# Altium schematic sheet 7V_Buck.SchDoc
size 259 x 167 mm; SheetNumber: 5; SheetTotal: 7
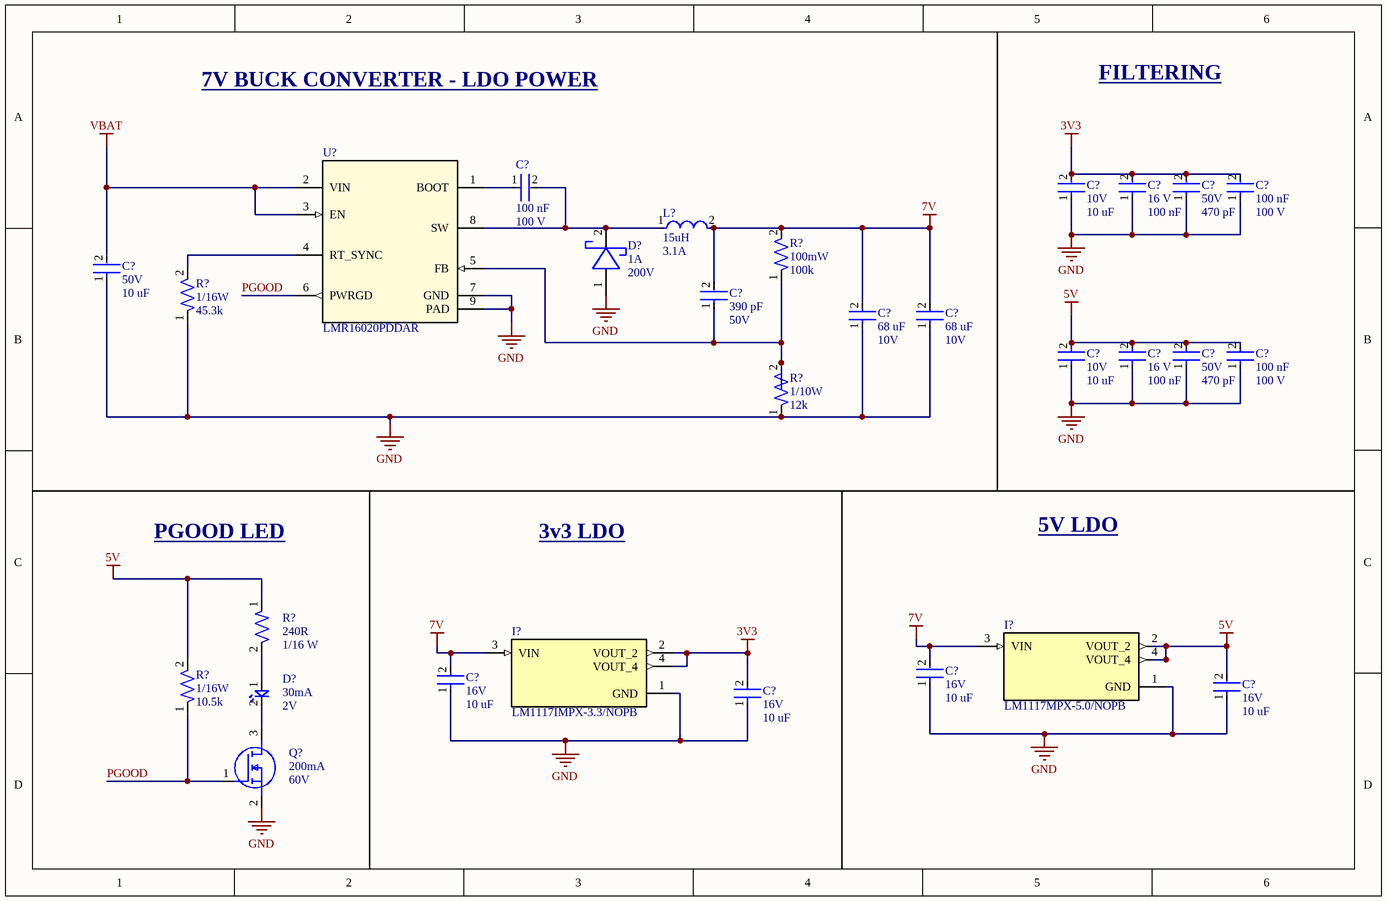
[diagram p0: 7V_Buck.SchDoc]

## Parts
(Parts that share a designator on the sheet are numbered #1, #2 ... from top to bottom, then left to right.)
C?#1  Capacitance: 100 nF  Voltage: 100 V  [CAP-0603]  (hidden comment: CC0603KRX7R0BB104)
C?#2  Voltage: 10V  Capacitance: 10 uF  [CAP-0603]  (hidden comment: CC0603KRX5R6BB106)
C?#3  Voltage Rating: 16 V  Capacitance: 100 nF  [CAP-0402]  (hidden comment: CC0402KRX7R7BB104)
C?#4  Voltage: 50V  Capacitance: 470 pF  [CAP-0805]  (hidden comment: CC0805JRNPO9BN471)
C?#5  Capacitance: 100 nF  Voltage: 100 V  [CAP-0603]  (hidden comment: CC0603KRX7R0BB104)
C?#6  Voltage Rating (DC): 50V  Capacitance: 10 uF  [FP-CL32-IPC_B]  (hidden comment: CL32B106KBJNNNE)
C?#7  Capacitance: 390 pF  Voltage: 50V  [CAP-0402]  (hidden comment: GRM155R71H391KA01D)
C?#8  Capacitance: 68 uF  Voltage: 10V  [CAP-1210]  (hidden comment: C5750X5R1A686MT000N)
C?#9  Capacitance: 68 uF  Voltage: 10V  [CAP-1210]  (hidden comment: C5750X5R1A686MT000N)
C?#10  Voltage: 10V  Capacitance: 10 uF  [CAP-0603]  (hidden comment: CC0603KRX5R6BB106)
C?#11  Voltage Rating: 16 V  Capacitance: 100 nF  [CAP-0402]  (hidden comment: CC0402KRX7R7BB104)
C?#12  Voltage: 50V  Capacitance: 470 pF  [CAP-0805]  (hidden comment: CC0805JRNPO9BN471)
C?#13  Capacitance: 100 nF  Voltage: 100 V  [CAP-0603]  (hidden comment: CC0603KRX7R0BB104)
C?#14  Voltage: 16V  Capacitance: 10 uF  [CAP-1210]  (hidden comment: 293D106X9016A2TE3)
C?#15  Voltage: 16V  Capacitance: 10 uF  [CAP-1210]  (hidden comment: 293D106X9016A2TE3)
C?#16  Voltage: 16V  Capacitance: 10 uF  [CAP-1210]  (hidden comment: 293D106X9016A2TE3)
C?#17  Voltage: 16V  Capacitance: 10 uF  [CAP-1210]  (hidden comment: 293D106X9016A2TE3)
D?#1  Current Rating: 1A  Reverse Voltage: 200V  [SMA_DIO]  (hidden comment: SS1200)
D?#2  Current Rating: 30mA  Vf: 2V  [LED0603-R-RD]  (hidden comment: BL-HKC36G-AV-TRB)
I?#1  LM1117MPX-5.0/NOPB  [IC-SOT-223-4]
I?#2  LM1117IMPX-3.3/NOPB  [IC-SOT-223-4]
L?  Inductance: 15uH  Current Rating: 3.1A  [IND-15UH-0001]  (hidden comment: CSAD1010-150M)
Q?  Id-Continuous: 200mA  VDS-Max: 60V  [NMOS-SOT23-3]  (hidden comment: T2N7002AK,LM)
R?#1  Power: 100mW  Resistance: 100k  [RES-0603]  (hidden comment: RC0603FR-07100KL)
R?#2  Power: 1/16W  Resistance: 45.3k  [RES-0402]  (hidden comment: RC0402FR-0745K3L)
R?#3  Power: 1/10W  Resistance: 12k  [RES-0603]  (hidden comment: RC0603FR-0712KL)
R?#4  Resistance: 240R  Power: 1/16 W  [RESC0402(1005)_L]  (hidden comment: RC0402FR-07240RL)
R?#5  Power: 1/16W  Resistance: 10.5k  [RES-0402]  (hidden comment: RC0402FR-0710K5L)
U?  LMR16020PDDAR  [IC-8SOPWR]

## Nets
3V3: C?#2.2 C?#3.2 C?#4.2 C?#5.2 C?#17.2 I?#2.2(VOUT_2) I?#2.4(VOUT_4)
5V: C?#10.2 C?#11.2 C?#12.2 C?#13.2 C?#16.2 I?#1.2(VOUT_2) I?#1.4(VOUT_4) R?#4.1 R?#5.2
7V: C?#7.2 C?#8.2 C?#9.2 C?#14.2 C?#15.2 I?#1.3(VIN) I?#2.3(VIN) L?.2 R?#1.2
GND: C?#2.1 C?#3.1 C?#4.1 C?#5.1 C?#6.1 C?#8.1 C?#9.1 C?#10.1 C?#11.1 C?#12.1 C?#13.1 C?#14.1 C?#15.1 C?#16.1 C?#17.1 D?#1.1(CATHODE) I?#1.1(GND) I?#2.1(GND) Q?.2(S) R?#2.1 R?#3.1 U?.7(GND) U?.9(PAD)
VBAT: C?#6.2 U?.2(VIN) U?.3(EN)
PGOOD: Q?.1(G) R?#5.1 U?.6(PWRGD)
NetC?#1_1: C?#1.1 U?.1(BOOT)
NetC?#1_2: C?#1.2 D?#1.2(ANODE) L?.1 U?.8(SW)
NetC?#7_1: C?#7.1 R?#1.1 R?#3.2 U?.5(FB)
NetD?#2_1: D?#2.1 R?#4.2
NetD?#2_2: D?#2.2 Q?.3(D)
NetR?#2_2: R?#2.2 U?.4(RT_SYNC)

## Notes on the sheet
- 7V BUCK CONVERTER - LDO POWER
- FILTERING
- PGOOD LED
- 3v3 LDO
- 5V LDO

## Library data of the parts
C?#1 C?#5 C?#13 = CAP-100N-0001: CAP CER 0.1UF 100V X7R 0603; Device Class: Ceramic; Size: 0603; ComponentLink1Description: Datasheet; ComponentLink1URL: https://www.yageo.com/upload/media/product/app/datasheet/mlcc/upy-np0x7r_mv_100-to-630v.pdf
C?#2 C?#10 = CAP-10U-0001: CAP CER 10UF 10V X5R 0603; ComponentLink1Description: Datasheet; ComponentLink1URL: https://www.yageo.com/upload/media/product/app/datasheet/mlcc/upy-gphc_x5r_4v-to-50v.pdf; Device Class: Ceramic; Size: 0603
C?#3 C?#11 = CAP-0.1U-0001: CAP CER 0.1UF 16V X7R 0402; ComponentLink2Description: Datasheet; ComponentLink2URL: https://www.yageo.com/upload/media/product/productsearch/datasheet/mlcc/UPY-GPHC_X7R_6.3V-to-250V_24.pdf; Device Class: Ceramic; Size: 0402
C?#4 C?#12 = CAP-470P-0001: CAP CER 470PF 50V C0G/NPO 0805; Device Class: Ceramic; Size: 0805; ComponentLink1Description: Datasheet; ComponentLink1URL: https://www.yageo.com/upload/media/product/productsearch/datasheet/mlcc/UPY-GP_NP0_16V-to-50V_18.pdf
C?#6 = CAP-10U-0002: CAP CER 10UF 50V X7R 1210; Tolerance: 10%; Material: Ceramic; Min Operating Temperature: -55°C; Depth: 2.5mm; Radiation Hardening: No; Packaging: Tape and Reel; Dielectric: X7R; Case Code (Metric): 3225; Height: 2.5mm; Thickness: 0.106inch; Voltage Rating: 50V; Width: 0.098inch; Case Code (Imperial): 1210; Length: 3.2mm; Lead Free: Lead Free; Package Quantity: 1; Voltage: 50V; Mount: Surface Mount; Case/Package: 1210; Max Operating Temperature: 125°C
C?#7 = CAP-390P-0001_1: CAP CER 390PF 50V X7R 0402; Device Class: Ceramic; Size: 0402; ComponentLink1Description: Datasheet; ComponentLink1URL: https://www.lcsc.com/datasheet/lcsc_datasheet_1912111437_Murata-Electronics-GRM155R71H391KA01D_C185563.pdf
C?#8 C?#9 = CAP-68U-0001: CAP CER 68UF 10V X5R 2220; Device Class: Ceramic; Size: 2220; ComponentLink1Description: Datasheet; ComponentLink1URL: https://www.lcsc.com/datasheet/lcsc_datasheet_2304140030_TDK-C5750X5R1A686MT000N_C342299.pdf
C?#14-C?#17 = CAP-10U-0003: CAP TANT 10UF 10% 16V 1206; Device Class: Tantalum; Size: 1206; ComponentLink1Description: Datasheet; ComponentLink1URL: https://www.lcsc.com/datasheet/lcsc_datasheet_2304140030_Vishay-Intertech-293D106X9016A2TE3_C110038.pdf
D?#1 = DIO-SCHOTTKY-0004: DIODE SCHOTTKY 200V 1A SMA; ComponentLink1Description: Datasheet; ComponentLink1URL: https://www.digikey.com/en/products/detail/mdd/ss1200/15911596
D?#2 = LED-0001: LED YELLOW CLEAR 0603 SMD
I?#1 = IC_LDO_5V_0001: IC REG LINEAR 5V 800MA SOT223-4; ComponentLink1Description: Datasheet; ComponentLink1URL: https://www.ti.com/lit/ds/symlink/lm1117.pdf?HQS=dis-dk-null-digikeymode-dsf-pf-null-wwe&ts=1721700739746
I?#2 = IC_LDO_3V3_0001: IC REG LIN 3.3V 800MA SOT223-4; ComponentLink1Description: New link; ComponentLink1URL: https://www.ti.com/lit/ds/symlink/lm1117.pdf?HQS=dis-dk-null-digikeymode-dsf-pf-null-wwe&ts=1721700739746
L? = IND-15U-0001-NoJLC: FIXED IND 15UH 3.1A 50 MOHM SMD; ComponentLink1Description: Datasheet; ComponentLink1URL: https://www.eaton.com/content/dam/eaton/products/electronic-components/resources/data-sheet/eaton-dr1040-shielded-power-inductors-data-sheet.pdf
Q? = NMOS-200MA-0001: MOSFET N-CH 60V 200MA SOT23; Manufacturer: Toshiba; FET type: N-Channel; Rds On-Max: 3.9Ohm; Vgs-Max: 20V; Assembled?: no; Manufacturer Part Number: T2N7002AK,LM; Package: SOT-23-3
R?#1 = RES-100k-0001: RES SMD 100K OHM 1% 1/10W 0603; Tolerance: 1%; Size: 0603; ComponentLink1Description: Datasheet; ComponentLink1URL: https://www.yageo.com/upload/media/product/products/datasheet/rchip/PYu-RC_Group_51_RoHS_L_12.pdf
R?#2 = RES-43.5k-0001: RES 45.3K OHM 1% 1/16W 0402; Tolerance: 1%; Size: 0402; ComponentLink1Description: Datasheet; ComponentLink1URL: https://www.lcsc.com/datasheet/lcsc_datasheet_2304140030_YAGEO-RC0402FR-0745K3L_C137977.pdf
R?#3 = RES-12k-0001: RES 12K OHM 1% 1/10W 0603; Tolerance: 1%; Size: 0603; ComponentLink1Description: Datasheet; ComponentLink1URL: https://www.lcsc.com/datasheet/lcsc_datasheet_2304140030_YAGEO-RC0603FR-0712KL_C114659.pdf
R?#4 = RES-240-0001: 240R 0.063W 1% 0402 (1005 Metric)  SMD; Case-Metric: 1005; Case-EIA: 0402; Value: 240.00 Ohm; Tolerance: 1 %; Technology: SMT
R?#5 = RES-10.5k-0001: RES 10.5K OHM 1% 1/16W 0402; Tolerance: 1%; Size: 0402; ComponentLink1Description: Datasheet; ComponentLink1URL: https://www.yageo.com/upload/media/product/products/datasheet/rchip/PYu-RC_Group_51_RoHS_L_12.pdf
U? = IC_BUCK_7V_0001: IC REG BUCK ADJ 2A 8SOPWR; ComponentLink1Description: Datasheet; ComponentLink1URL: https://www.ti.com/general/docs/suppproductinfo.tsp?distId=10&gotoUrl=https%3A%2F%2Fwww.ti.com%2Flit%2Fgpn%2Flmr16020